# EasyEDA schematic Triple Bypass v2.json
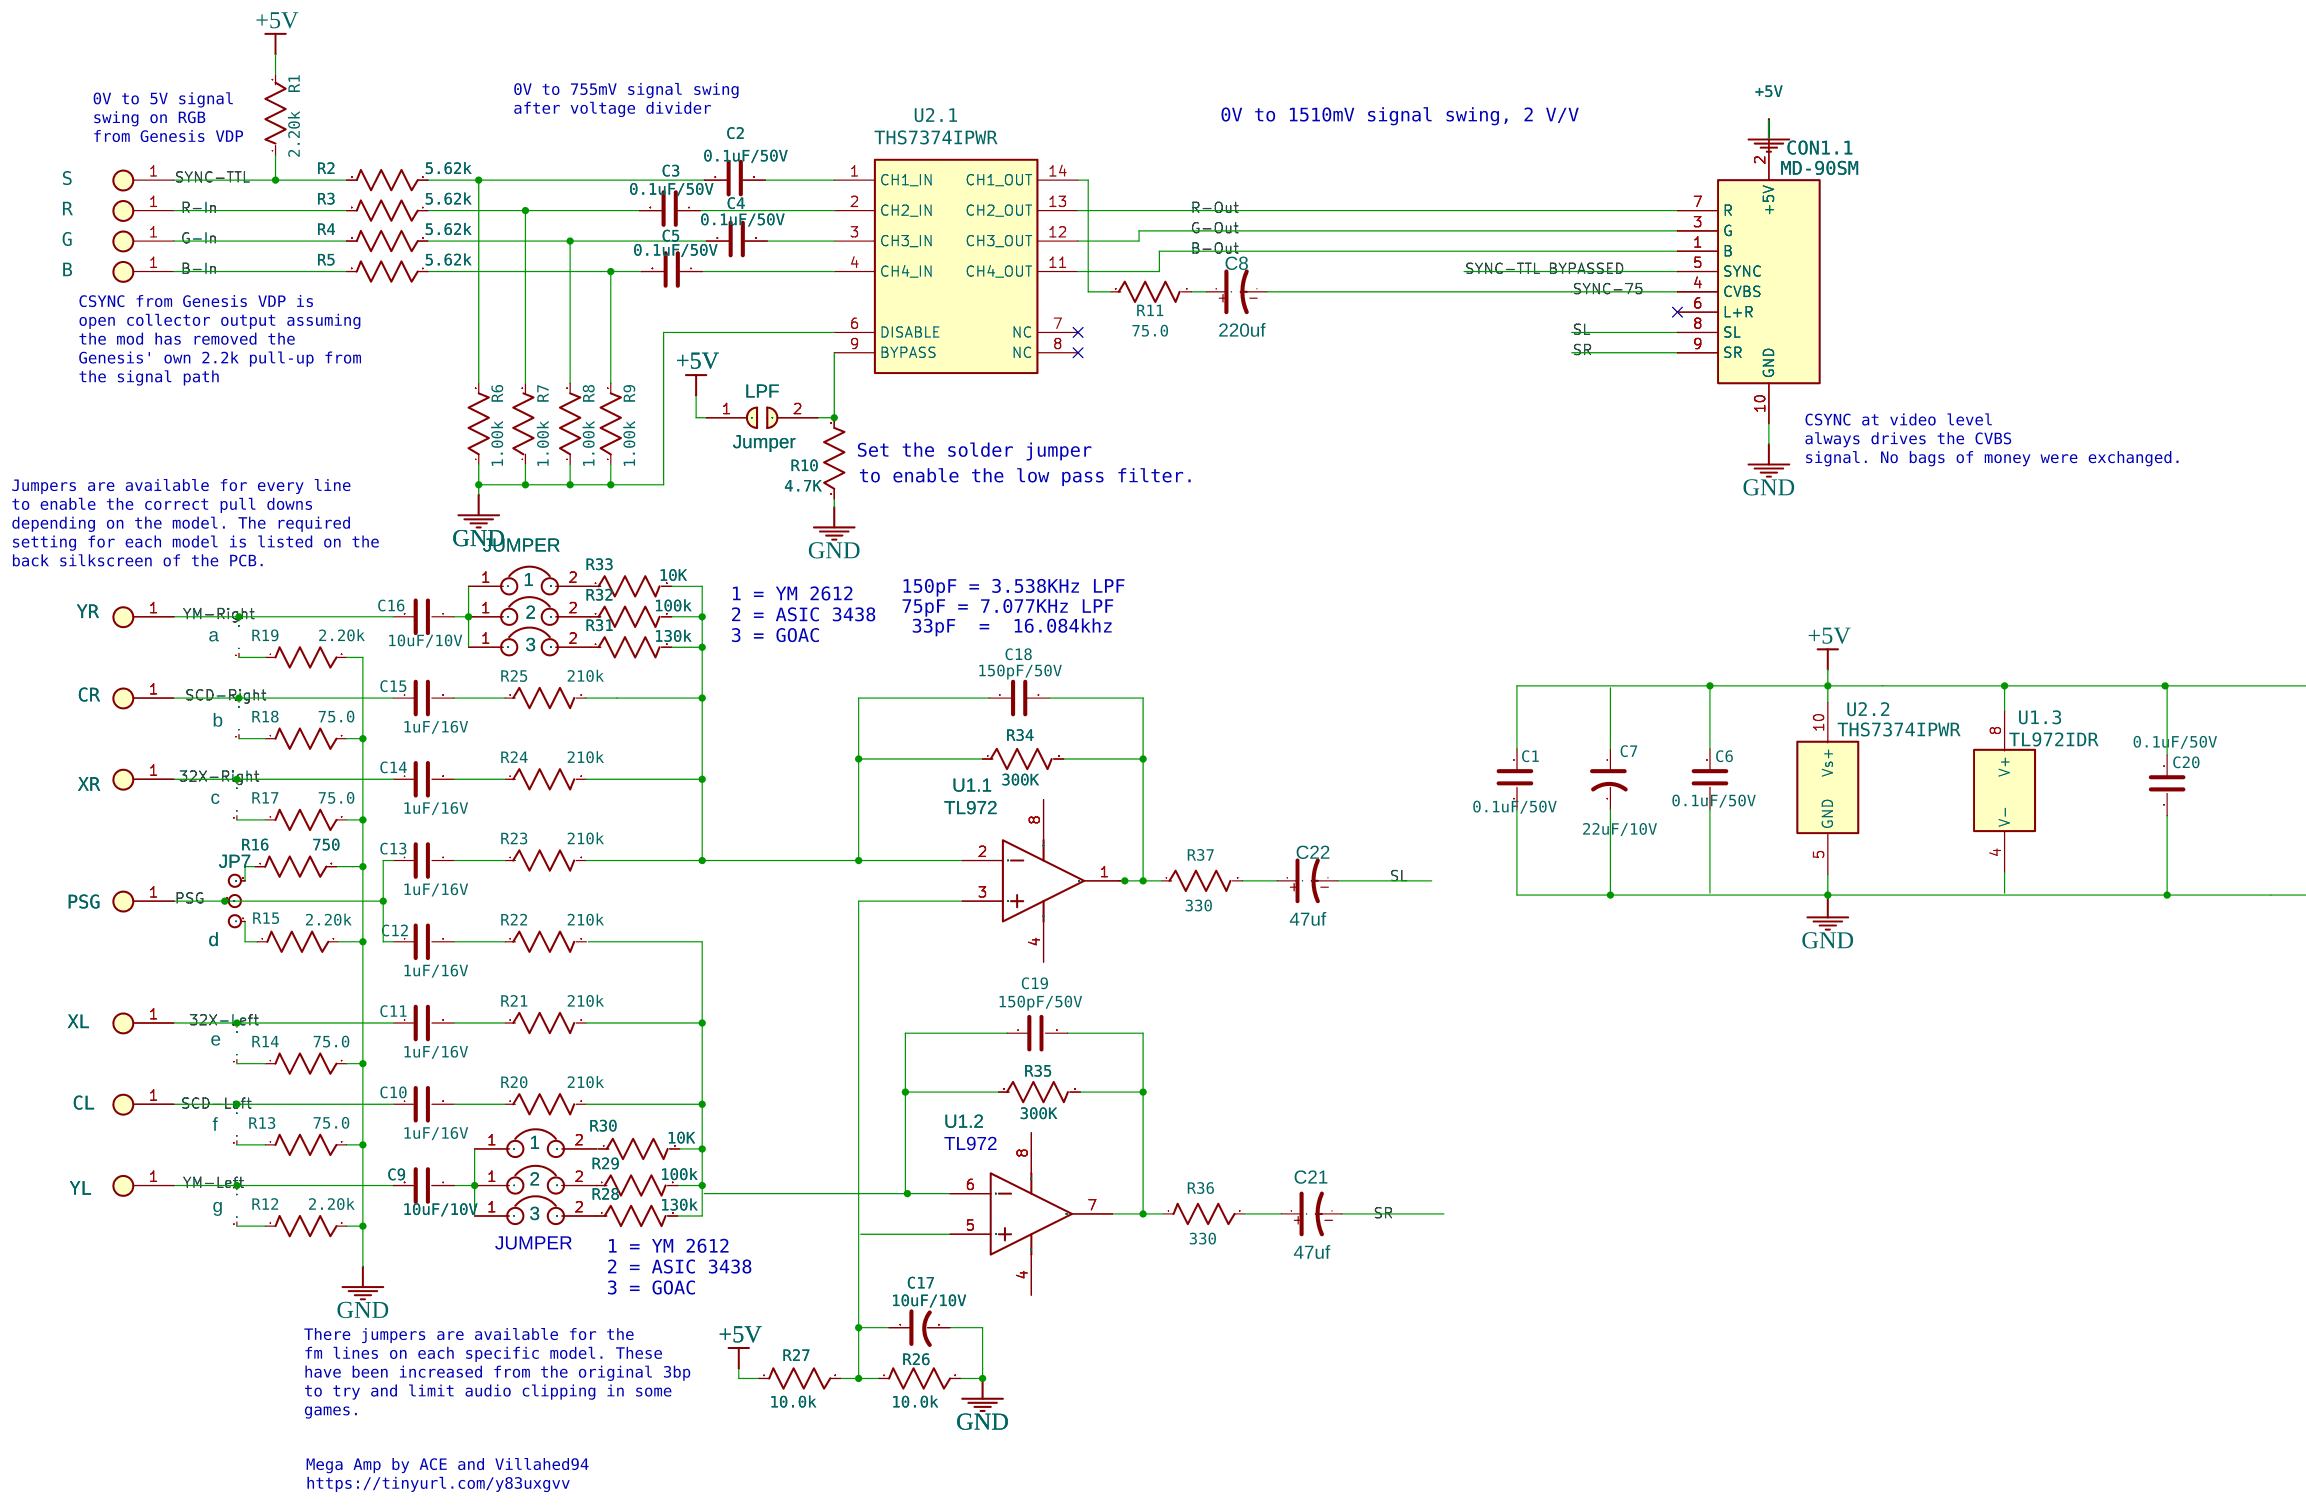
[diagram p0: schematic sheet]

## Parts
1  JUMPER  [JUMPER2]
1#2  JUMPER  [JUMPER2]
2  JUMPER  [JUMPER2]
2#2  JUMPER  [JUMPER2]
3  JUMPER  [JUMPER2]
3#2  JUMPER  [JUMPER2]
B  TP_50  [TP50]
C1  0.1uF/50V  [0603]
C2  0.1uF/50V  [0603]
C3  0.1uF/50V  [0603]
C4  0.1uF/50V  [0603]
C5  0.1uF/50V  [0603]
C6  0.1uF/50V  [0603]
C7  22uF/10V  [1206_P]
C8  220uf  [CP_TANTALUM_CASE-B_EIA-3528-21_HAND]
C9  10uF/10V  [0805]
C10  1uF/16V  [0603]
C11  1uF/16V  [0603]
C12  1uF/16V  [0603]
C13  1uF/16V  [0603]
C14  1uF/16V  [0603]
C15  1uF/16V  [0603]
C16  10uF/10V  [0805]
C17  10uF/10V  [1206_P]
C18  150pF/50V  [0603]
C19  150pF/50V  [0603]
C20  0.1uF/50V  [0603]
C21  47uf  [CP_TANTALUM_CASE-B_EIA-3528-21_HAND]
C22  47uf  [CP_TANTALUM_CASE-B_EIA-3528-21_HAND]
CL  TP_50  [TP50]
CON1  MD-90SM  [MD-90SM]  (section 1)
CR  TP_50  [TP50]
G  TP_50  [TP50]
JP1  b  [JUMP2]
JP2  c  [JUMP2]
JP3  g  [JUMP2]
JP4  e  [JUMP2]
JP5  f  [JUMP2]
JP6  a  [JUMP2]
JP7  d  [JUMP3]
LPF  Jumper  [JUMPER PAD]
PSG  TP_50  [TP50]
R  TP_50  [TP50]
R1  2.20k  [0603]
R2  5.62k  [0603]
R3  5.62k  [0603]
R4  5.62k  [0603]
R5  5.62k  [0603]
R6  1.00k  [0603]
R7  1.00k  [0603]
R8  1.00k  [0603]
R9  1.00k  [0603]
R10  4.7K  [0603]
R11  75.0  [0603]
R12  2.20k  [0603]
R13  75.0  [0603]
R14  75.0  [0603]
R15  2.20k  [0603]
R16  750  [0603]
R17  75.0  [0603]
R18  75.0  [0603]
R19  2.20k  [0603]
R20  210k  [0603]
R21  210k  [0603]
R22  210k  [0603]
R23  210k  [0603]
R24  210k  [0603]
R25  210k  [0603]
R26  10.0k  [0603]
R27  10.0k  [0603]
R28  130k  [0603]
R29  100k  [0603]
R30  10K  [0603]
R31  130k  [0603]
R32  100k  [0603]
R33  10K  [0603]
R34  300K  [0603]
R35  300K  [0603]
R36  330  [0603]
R37  330  [0603]
S  TP_50  [TP50]
U1  TL972  [SOP-8_150MIL]  (sections 1,2,3)
U2  THS7374IPWR  [TSSOP-14]  (sections 1,2)
XL  TP_50  [TP50]
XR  TP_50  [TP50]
YL  TP_50  [TP50]
YR  TP_50  [TP50]

## Library data of the parts
1 1#2 2 2#2 3 3#2 = -: Contributor: KiCad; Manufacturer Part: ?
B CL CR G PSG R S XL XR YL YR = -: 0.05" x 0.05" SMT Test Point; Digikey: #ND
C1-C6 C20 = -: CAP CER 0.1UF 50V X7R 0603; Digikey: 445-5666-1-ND
C7 C17 = -: CAP TANT 22UF 10V 10% 1206; Digikey: 478-1663-1-ND
C8 C21 C22 = -: SMD CAP Tantalum 10uF-16V (B-3528); Manufacturer Part: ?
C9 C16 = -: CAP CER 10UF 10V X5R 0805; Digikey: 311-1460-1-ND
C10-C15 = -: CAP CER 1UF 16V X5R 0603; Digikey: 445-1416-1-ND
C18 C19 = -: CAP CER 180PF 50V X7R 0603; Digikey: 311-4096-6-ND
CON1 = -: CONN RCPT FMALE MINI DIN 9P SLDR; Datasheet: http://www.cui.com/product/resource/digikeypdf/md-sm-series.pdf; Digikey: CP-2290-ND
LPF = -: Manufacturer Part: ?; Contributor: Terris-1992
R1 = -: RES SMD 2.20K OHM 1% 1/10W 0603; Digikey: P2.20KHCT-ND
R2-R5 = -: RES SMD 5.62K OHM 1% 1/10W 0603; Digikey: P5.62KHCT-ND
R6-R9 = -: RES SMD 1K OHM 1% 1/10W 0603; Digikey: P1.00KHCT-ND
R10 = -: RES SMD 100K OHM 1% 1/10W 0603; Digikey: RHM100KAYCT-ND
R11 = -: Digikey: P75.0HCT-ND
R12 R19 = -: RES 2.20k OHM 1/10W 1% 0603 SMD; Digikey: P2.20KHCT-ND
R13 R14 R17 R18 = -: RES 75.0 OHM 1/10W 1% 0603 SMD; Digikey: P75.0HCT-ND
R15 R16 = -: RES 2.20K OHM 1/10W 1% 0603 SMD; Digikey: P2.20KHCT-ND
R20 = -: RES 130K OHM 1/10W 1% 0603 SMD; Digikey: P130KHCT-ND
R21 = -: RES 210K OHM 1/10W 1% 0603 SMD
R22 = -: RES 210K OHM 1/10W 1% 0603 SMD; Digikey: P120KHCT-ND
R23 = -: RES 210k OHM 1/10W 1% 0603 SMD; Digikey: P120KHCT-ND
R24 = -: RES 210k  OHM 1/10W 1% 0603 SMD
R25 = -: RES 210k OHM 1/10W 1% 0603 SMD; Digikey: P130KHCT-ND
R26 R27 = -: RES 10.0K OHM 1/10W 1% 0603 SMD; Digikey: P10.0KHCT-ND
R28-R33 = -: RES 6.19K OHM 1/10W 1% 0603 SMD; Digikey: P6.19KHCT-ND
R34 R35 = -: RES 240K OHM 1/10W 1% 0603 SMD; Digikey: P240KHCT-ND
R36 R37 = -: RES 332 OHM 1/10W 1% 0603 SMD; Digikey: P332HCT-ND
U1 = -: tags: Low Noise Operational Amplifier; Supplier Part: C46127; Supplier: LCSC; Manufacturer: TI; Manufacturer Part: TL972IDR; subpart_no: 1
U2 = -: IC SDTV VIDEO AMP 4-CH 14-TSSOP; Datasheet: http://www.ti.com/lit/ds/symlink/ths7374.pdf; Digikey: 296-41661-1-ND

## Nets
+5V: C1.1 C6.1 C20.1 CON1.2(+5V) LPF.1 R1.2 R27.1 U1.8(VCC+) U2.10(Vs+)
GND: C17.2 CON1.10(GND) R6.1 R7.1 R8.1 R9.1 R10.1 R12.2 R13.2 R14.2 R15.2 R16.2 R17.2 R18.2 R19.2 R26.2 U2.6(DISABLE)
32X-Left: C11.1 JP4.2 XR.1
32X-Right: C14.1 JP2.2 XL.1
B-In: B.1 R5.2
B-Out: CON1.1(B) U2.11(CH4_OUT)
G-In: G.1 R4.2
G-Out: CON1.3(G) U2.12(CH3_OUT)
PSG: C12.1 C13.1 JP7.2 PSG.1
R-In: R.1 R3.2
R-Out: CON1.7(R) U2.13(CH2_OUT)
SCD-Right: C15.1 CL.1 JP1.2
SL: CON1.8(SL)
SR: CON1.9(SR)
SYNC-75: C8.- CON1.4(CVBS)
SYNC-TTL: R1.1 R2.2 S.1
SYNC-TTL BYPASSED: CON1.5(SYNC)
YM-Left: C9.2 JP3.2 YR.1
YM-Right: C16.2 JP6.2 YL.1
Net-(1#2-1): 1#2.1 2#2.1 3#2.1 C9.1
Net-(1#2-2): 1#2.2 R30.1
Net-(1-1): 1.1 2.1 3.1 C16.1
Net-(1-2): 1.2 R33.1
Net-(2#2-2): 2#2.2 R29.1
Net-(2-2): 2.2 R32.1
Net-(3#2-2): 3#2.2 R28.1
Net-(3-2): 3.2 R31.1
Net-(C1-2): C1.2 C7.2 C20.2 U2.5(GND)
Net-(C2-1): C2.1 U2.1(CH1_IN)
Net-(C2-2): C2.2 R2.1 R6.2
Net-(C3-1): C3.1 U2.2(CH2_IN)
Net-(C3-2): C3.2 R3.1 R7.2
Net-(C4-1): C4.1 U2.3(CH3_IN)
Net-(C4-2): C4.2 R4.1 R8.2
Net-(C5-1): C5.1 U2.4(CH4_IN)
Net-(C5-2): C5.2 R5.1 R9.2
Net-(C8-+): C8.+ R11.1
Net-(C10-1): C10.1 CR.1 JP5.2
Net-(C10-2): C10.2 R20.1
Net-(C11-2): C11.2 R21.1
Net-(C12-2): C12.2 R22.1
Net-(C13-2): C13.2 R23.1
Net-(C14-2): C14.2 R24.1
Net-(C15-2): C15.2 R25.1
Net-(C17-1): C17.1 R26.1 R27.2 U1.3(IN1+)
Net-(C18-1): C18.1 R23.2 R24.2 R25.2 R31.2 R32.2 R33.2 R34.1 U1.2(IN1-)
Net-(C18-2): C18.2 R34.2 R37.1 U1.1(OUT1)
Net-(C19-1): C19.1 R35.1 U1.6(IN2-)
Net-(C19-2): C19.2 R35.2 R36.1 U1.7(OUT2)
Net-(C21-+): C21.+ R36.2
Net-(C22-+): C22.+ R37.2
Net-(JP1-1): JP1.1 R18.1
Net-(JP2-1): JP2.1 R17.1
Net-(JP3-1): JP3.1 R12.1
Net-(JP4-1): JP4.1 R14.1
Net-(JP5-1): JP5.1 R13.1
Net-(JP6-1): JP6.1 R19.1
Net-(JP7-1): JP7.1 R15.1
Net-(JP7-3): JP7.3 R16.1
Net-(LPF-2): LPF.2 R10.2 U2.9(BYPASS)
Net-(R11-2): R11.2 U2.14(CH1_OUT)
Net-(R20-2): R20.2 R21.2 R28.2 R29.2 R30.2

Not connected (* = marked no-connect by the designer): C6 2; C7 1; C21 -; C22 -; CON1 6(L+R)*; R22 2; U1 4(VCC-) 5(IN2+); U2 7(NC)* 8(NC)*

## Notes on the sheet
- 0V to 5V signal
  swing on RGB
  from Genesis VDP
- 0V to 755mV signal swing
  after voltage divider
- 0V to 1510mV signal swing, 2 V/V
- CSYNC from Genesis VDP is
  open collector output assuming
  the mod has removed the
  Genesis' own 2.2k pull-up from
  the signal path
- CSYNC at video level
  always drives the CVBS
  signal. No bags of money were exchanged.
- Set the solder jumper
- to enable the low pass filter.
- Jumpers are available for every line
  to enable the correct pull downs
  depending on the model. The required
  setting for each model is listed on the
  back silkscreen of the PCB.
- 1 = YM 2612
- 150pF = 3.538KHz LPF
- 2 = ASIC 3438
- 75pF = 7.077KHz LPF
- 33pF  =  16.084khz
- 3 = GOAC
- CON1.2
- MD-90SM
- TL972
- JUMPER
- 1 = YM 2612
- 2 = ASIC 3438
- 3 = GOAC
- There jumpers are available for the
  fm lines on each specific model. These
  have been increased from the original 3bp
  to try and limit audio clipping in some
  games.
- Mega Amp by ACE and Villahed94
  https://tinyurl.com/y83uxgvv
